# Altium schematic sheet Header.SchDoc
size A3
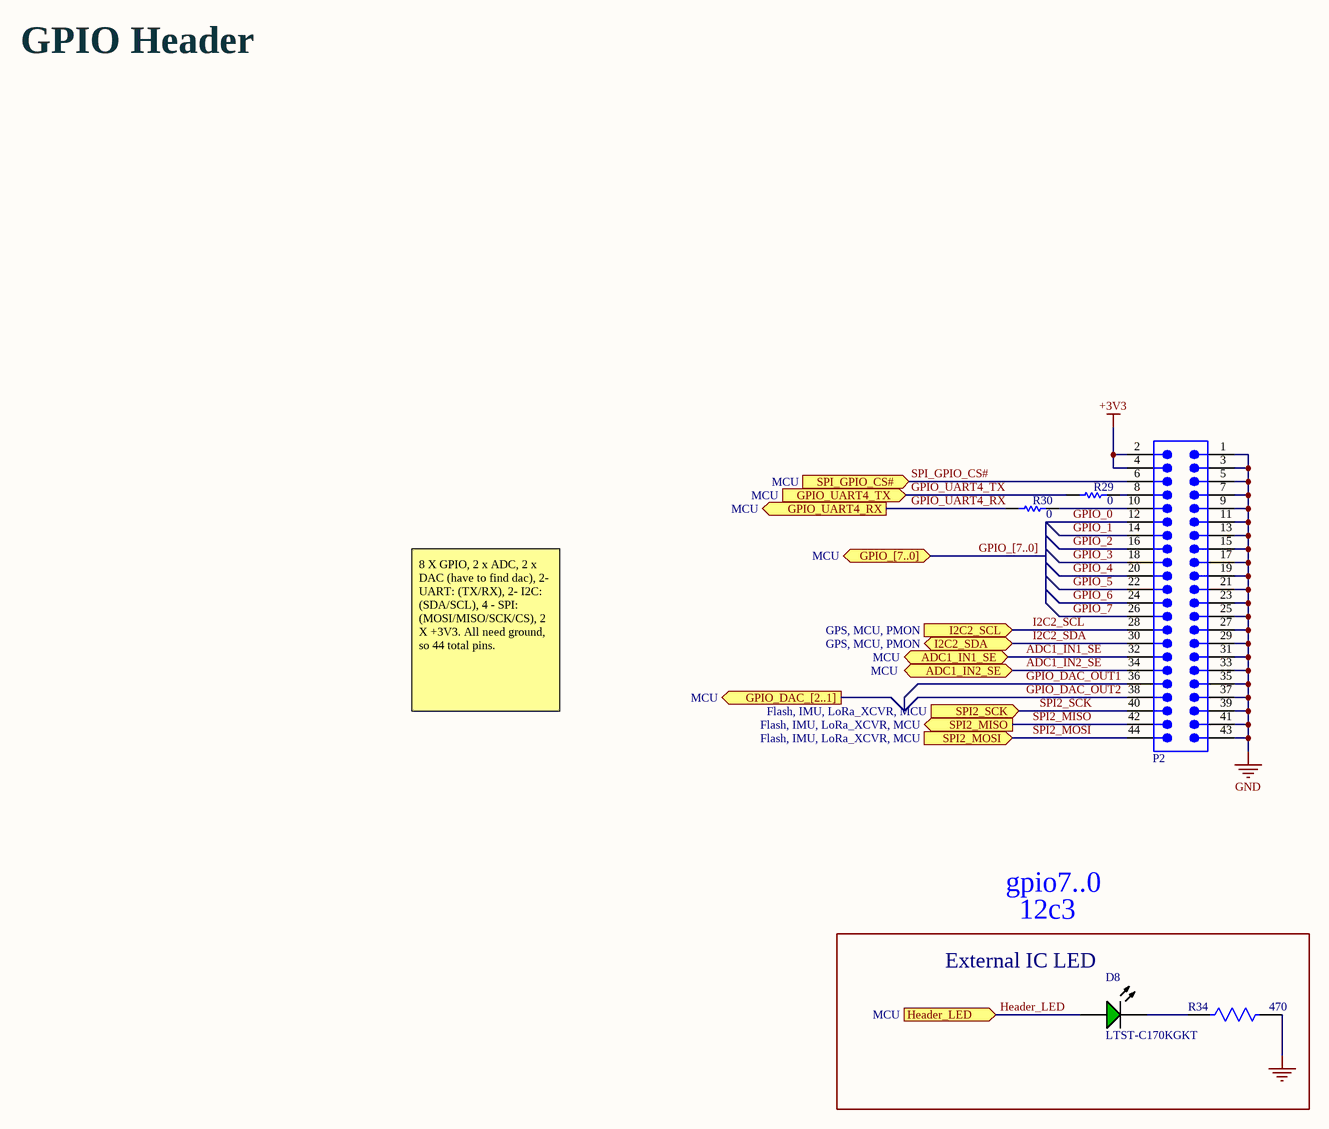
[diagram p0: Header.SchDoc]

## Parts
D8  LTST-C170KGKT  [LTST-LTST-C170KGKT-2_V]
P2  62004421121  [62004421121]  (value not drawn)
R29  0  [RESC1005X40X25LL05T05]
R30  0  [RESC1005X40X25LL05T05]
R34  470  [FP-CPF0603-MFG]

## Blocks framed on the sheet
12c3: D8 R34

## Ports
ADC1_IN1_SE (bidir, see MCU), ADC1_IN2_SE (bidir, see MCU), GPIO_[7..0] (bidir, see MCU), GPIO_DAC_[2..1] (out, see MCU), GPIO_UART4_RX (out, see MCU), GPIO_UART4_TX (in, see MCU), Header_LED (in, see MCU), I2C2_SCL (in, see GPS, MCU, PMON), I2C2_SDA (bidir, see GPS, MCU, PMON), SPI2_MISO (out, see Flash, IMU, LoRa_XCVR, MCU), SPI2_MOSI (in, see Flash, IMU, LoRa_XCVR, MCU), SPI2_SCK (in, see Flash, IMU, LoRa_XCVR, MCU), SPI_GPIO_CS# (in, see MCU)

## Nets
+3V3: P2.2 P2.4
GND: P2.1 P2.3 P2.5 P2.7 P2.9 P2.11 P2.13 P2.15 P2.17 P2.19 P2.21 P2.23 P2.25 P2.27 P2.29 P2.31 P2.33 P2.35 P2.37 P2.39 P2.41 P2.43 R34.2
ADC1_IN1_SE: P2.32 ; port ADC1_IN1_SE
ADC1_IN2_SE: P2.34 ; port ADC1_IN2_SE
GPIO_0: P2.12
GPIO_1: P2.14
GPIO_2: P2.16
GPIO_3: P2.18
GPIO_4: P2.20
GPIO_5: P2.22
GPIO_6: P2.24
GPIO_7: P2.26
GPIO_DAC_OUT1: P2.36
GPIO_DAC_OUT2: P2.38
GPIO_UART4_RX: R30.2 ; port GPIO_UART4_RX
GPIO_UART4_TX: R29.2 ; port GPIO_UART4_TX
Header_LED: D8.2(A) ; port Header_LED
I2C2_SCL: P2.28 ; port I2C2_SCL
I2C2_SDA: P2.30 ; port I2C2_SDA
SPI2_MISO: P2.42 ; port SPI2_MISO
SPI2_MOSI: P2.44 ; port SPI2_MOSI
SPI2_SCK: P2.40 ; port SPI2_SCK
SPI_GPIO_CS#: P2.6 ; port SPI_GPIO_CS#
NetD8_1: D8.1(K) R34.1
NetP2_8: P2.8 R29.1
NetP2_10: P2.10 R30.1

## Buses and harness runs
bus GPIO_[7..0] = port GPIO_[7..0]

## Notes on the sheet
- GPIO Header
- 8 X GPIO, 2 x ADC, 2 x DAC (have to find dac), 2- UART: (TX/RX), 2- I2C: (SDA/SCL), 4 - SPI: (MOSI/MISO/SCK/CS), 2 X +3V3. All need ground, so 44 total pins.
- gpio7..0
- (near D8) External IC LED

## Library data of the parts
D8 = CMP-2000-06620-1: Ultra Bright AlInGaP Chip LED, 75 mW, -55 to 85 degC, 2-Pin SMD (0805), RoHS, Tape and Reel; Manufacturer: Lite-On; Forward Current: 30mA; Power Dissipation Max: 75mW; Emitting Color: YellowGreen; Type: Uni-Color; Forward Voltage: 2.4V; Dominant Wave Length: 571nm; Test Current (It): 20mA; Product Length (mm): 2mm; Peak Wavelength: 574nm; Power Dissipation: 75W; Product Depth (mm): 1.25mm; DELETED: Compliant; High Brightness: Yes; Product Height (mm): 1.1mm; Luminous Intensity: 35mcd; Shape Type: Rectangular; Chip Material: AlGaInP; Viewing Angle: 130deg; Number of  Elements: 1; Reverse Voltage: 5V; Rad Hardened: No; Package Type: ChipLed; Manufacturer URL: http://www.us.liteon.com/; Mounting: SurfaceMount; Operating Temp Range: -55Cto85C; Datasheet URL: http://optoelectronics.liteon.com/upload/download/DS22-2000-073/S_110_LTST-C170KGKT.pdf; Packaging: TapeandReel; Pin Count: 2; Package Description: 2-Pin Surface Mounted Device, Body 2 x 1.25 mm; Mounting Technology: SurfaceMount; Package Reference: LTST-C170KGKT-2; Forward Current Max: 30mA; Datasheet Version: Rev. G, 06/2005; Lens Dimensions: 1.4x1.25x0.6mm; Operating Temperature Classification: Industrial; Lum Intensity: 35mcd; Main Category: ChipLED
P2 = CMP-1502-00974-3: NexarPartId: 61924794; Current Rating: 2A; Operating Supply Voltage: 200V; Gender: Male; Contact Resistance: 20mΩ; Number of Pins: 44; RoHS: Non-Compliant; Lead Pitch: 2mm; Orientation: Vertical
R29 R30 = CMP-2000-07451-1: Chip Resistor, 0 Ohm, 0.1 W, -55 to 155 degC, 0402 (1005 Metric), RoHS, Tape and Reel; Manufacturer: Panasonic; Voltage Rating (DC): 50V; Temperature Coefficient: 600ppm/��C; Max Power Dissipation: 100mW; Resistance: 0mOhm; Tolerance: 5%; Number of Terminations: 2; Mount: SurfaceMount; Height: 0.35mm; Packaging: TapeandReel; Contact Plating: Tin; Manufacturer URL: http://www.panasonic.com/; Composition: ThickFilm; Max Operating Temperature: 155degC; REACH SVHC: NoSVHC; Case/Package: 0402; Package Reference: 402; Depth: 0.5mm; Package Description: 2-Pin Surface Mount Device, Body 1 x 0.5 mm; Datasheet URL: https://industrial.panasonic.com/cdbs/www-data/pdf/RDA0000/AOA0000C301.pdf; RoHSCompliant: True; Case Code (Imperial): 0402; Military Standard: Not; Min Operating Temperature: -55degC; Power Rating: 100mW; Datasheet Version: 03/2015; Length: 1mm; Case Code (Metric): 1005; Termination: SMD/SMT; Mounting Technology: SurfaceMount; Voltage Rating: 50V; Width: 0.02inch; Package Quantity: 1; Lead Free: LeadFree; Radiation Hardening: No
R34 = CMP-03211-004765-1: RES SMD 470Ω 0.1% 1/16W 0603 / CPF0603B470RE; Manufacturer: TE Connectivity; Temperature Coefficient: 25ppm/°C; Voltage Rating: 50V; Power Rating: 0.063W; Value: 470Ω; Device Class L3: Chip SMD Resistors; RoHS: TRUE; Category: Res; Device Class L2: Resistors; Series: CPF; Height: 0.55mm; Temperature: -55°C to +155°C; Temperature Range High: +155°C; Automotive: No; octopart_url: https://octopart.com/cpf0603b470re-te+connectivity-23376607; packaging: 5k Reel; ComponentLink2Description: Datasheet; Temperature Range Low: -55°C; Device Class L1: Passive Components; Ipc Land Pattern Name: RESC15580X45; Package: CPF0603; Composition: Thin Film; Manufacturer Part Number: CPF0603B470RE; Resistance: 470Ω; Octopart: https://octopart.com/cpf0603b470re-te+connectivity-23376607; Lead Free: Yes; ComponentLink2URL: https://www.te.com/commerce/DocumentDelivery/DDEController?Action=showdoc&DocId=Data+Sheet%7F1773200%7FM%7Fpdf%7FEnglish%7FENG_DS_1773200_M.pdf%7F3-1676481-2; Tolerance: 0.1%